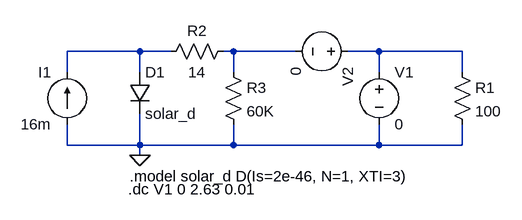
[diagram p0: schematic solar_cell_model.asc]
solar_cell_model.asc, the LTspice schematic file:
Version 4
SHEET 1 880 680
WIRE -16 64 -128 64
WIRE 32 64 -16 64
WIRE 128 64 112 64
WIRE 224 64 128 64
WIRE 352 64 304 64
WIRE 480 64 352 64
WIRE -128 96 -128 64
WIRE -16 96 -16 64
WIRE 128 96 128 64
WIRE 352 96 352 64
WIRE 480 96 480 64
WIRE -128 208 -128 176
WIRE -16 208 -16 160
WIRE -16 208 -128 208
WIRE 128 208 128 176
WIRE 128 208 -16 208
WIRE 352 208 352 176
WIRE 352 208 128 208
WIRE 480 208 480 176
WIRE 480 208 352 208
WIRE -16 224 -16 208
FLAG -16 224 0
SYMBOL current -128 176 R180
WINDOW 0 24 80 Left 2
WINDOW 3 24 0 Left 2
WINDOW 123 0 0 Left 2
WINDOW 39 0 0 Left 2
SYMATTR InstName I1
SYMATTR Value 16m
SYMBOL diode -32 96 R0
SYMATTR InstName D1
SYMATTR Value solar_d
SYMBOL voltage 352 80 R0
WINDOW 123 0 0 Left 2
WINDOW 39 0 0 Left 2
SYMATTR InstName V1
SYMATTR Value 0
SYMBOL res 464 80 R0
SYMATTR InstName R1
SYMATTR Value 100
SYMBOL voltage 320 64 R90
WINDOW 123 0 0 Left 2
WINDOW 39 0 0 Left 2
SYMATTR InstName V2
SYMATTR Value 0
SYMBOL res 128 48 R90
WINDOW 0 0 56 VBottom 2
WINDOW 3 32 56 VTop 2
SYMATTR InstName R2
SYMATTR Value 14
SYMBOL res 112 80 R0
SYMATTR InstName R3
SYMATTR Value 60K
TEXT -32 256 Left 2 !.model solar_d D(Is=2e-46, N=1, XTI=3)
TEXT -34 276 Left 2 !.dc V1 0 2.63 0.01

The netlist it stands for:
* solar_cell_model.asc
I1 0 N001 16m
D1 N001 0 solar_d
V1 N003 0 0
R1 N003 0 100
V2 N003 N002 0
R2 N002 N001 14
R3 N002 0 60K
.model D D
.lib standard.dio
.model solar_d D(Is=2e-46, N=1, XTI=3)
.dc V1 0 2.63 0.01
.backanno
.end